# EAGLE design jan_ray (EAGLE 7.6.0)
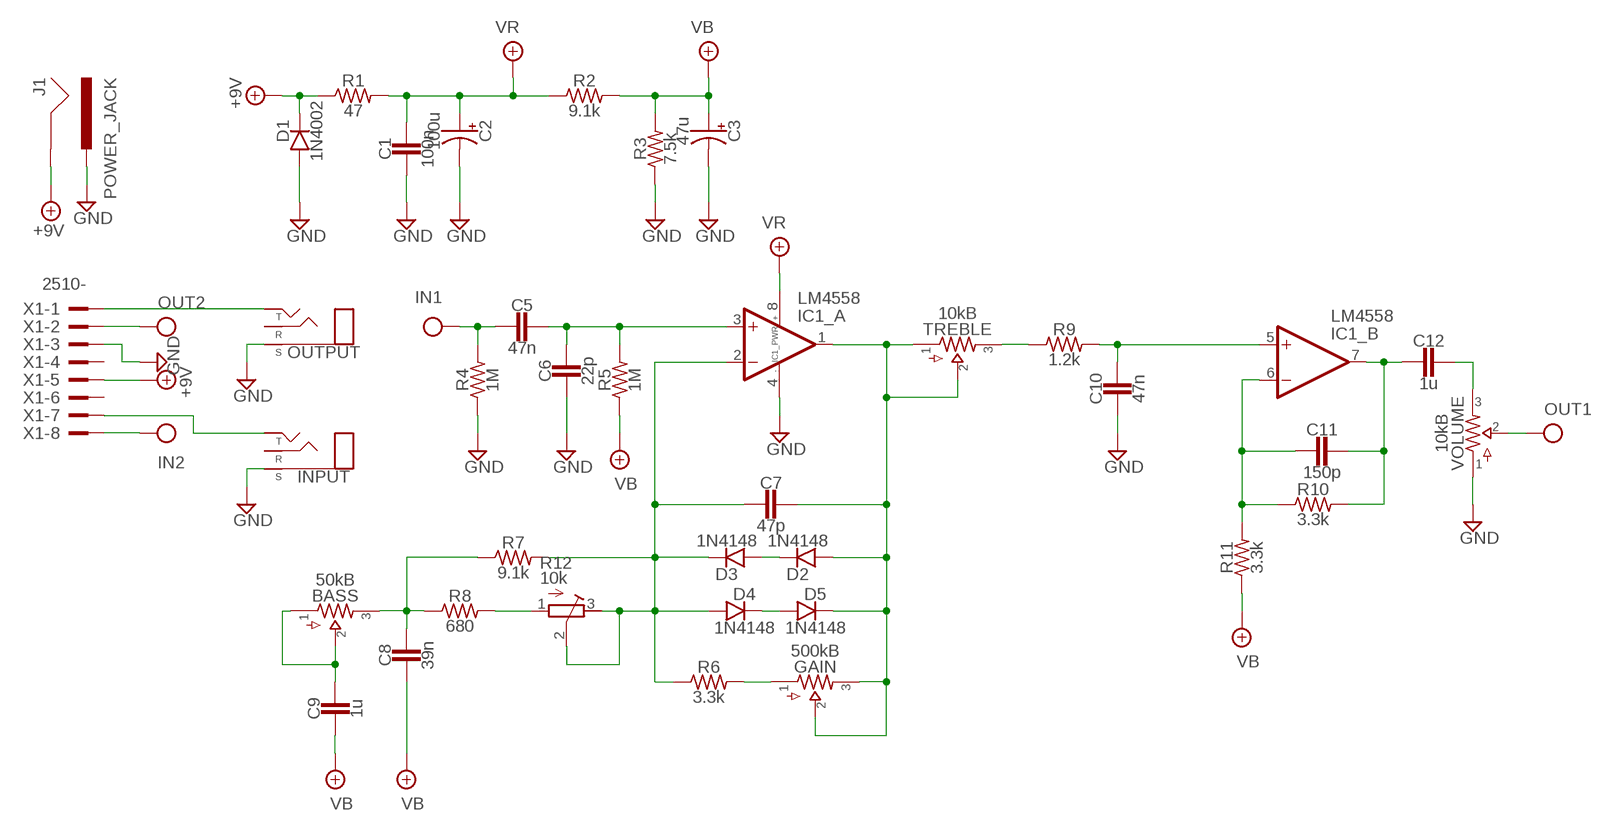
[diagram p0: schematic, sheet 1]

## Parts
BASS  50kB  POTS16MM  [16MM]
C1  100n  CER/FILM2  [050X030_025_2]
C2  100u  0500  [050_020]
C3  47u  0500  [050_020]
C5  47n  CER/FILMBOX.1  [BOX_SMALL]
C6  22p  CER/FILM2  [050X030_025_2]
C7  47p  CER/FILM2  [050X030_025_2]
C8  39n  CER/FILMBOX.1  [BOX_SMALL]
C9  1u  CER/FILMBOX.3  [BOX_BIG]
C10  47n  CER/FILMBOX.1  [BOX_SMALL]
C11  150p  CER/FILM2  [050X030_025_2]
C12  1u  CER/FILMBOX.3  [BOX_BIG]
D1  1N4002  DO41.2  [DO41-2]
D2  1N4148  DO35.2  [DO35-2]
D3  1N4148  DO35.2  [DO35-2]
D4  1N4148  DO35.2  [DO35-2]
D5  1N4148  DO35.2  [DO35-2]
GAIN  500kB  POTS16MM  [16MM]
IC1  LM4558  DUALTH  [DIL08]
INPUT  STEREONMJ  [NMJ6HCD2]
J1  POWER_JACK  [POWER_JACK_PTH]
OUTPUT  STEREONMJ  [NMJ6HCD2]
R1  47  R_.3B  [R0207/3]
R2  9.1k  R_.3B  [R0207/3]
R3  7.5k  R_.3B  [R0207/3]
R4  1M  R_.3B  [R0207/3]
R5  1M  R_.3B  [R0207/3]
R6  3.3k  R_.3B  [R0207/3]
R7  9.1k  R_.3B  [R0207/3]
R8  680  R_.3B  [R0207/3]
R9  1.2k  R_.3B  [R0207/3]
R10  3.3k  R_.3B  [R0207/3]
R11  3.3k  R_.3B  [R0207/3]
R12  10k  R-TRIMM3296W  [RTRIM3296W]
TREBLE  10kB  POTS16MM  [16MM]
VOLUME  10kB  POTS16MM  [16MM]
X1  2510-  [PAK100/2500-10]

## Nets
+9V: D1.C J1.GND R1.1 X1.5
GND: C1.2 C2.- C3.- C6.2 C10.2 D1.A IC1.4(_PWR:V-) INPUT.S J1.PWR OUTPUT.S R3.1 R4.1 VOLUME.1 X1.3
IN: C5.2 R4.2 X1.8
N$2: INPUT.T X1.7
N$3: C5.1 C6.1 IC1.3(_A:+IN) R5.2
N$4: OUTPUT.T X1.1
N$5: C7.2 D3.C D4.A IC1.2(_A:-IN) R6.1 R7.2 R12.2(S) R12.3(E)
N$6: C7.1 D2.A D5.C GAIN.2 GAIN.3 IC1.1(_A:OUT) TREBLE.1 TREBLE.2
N$7: GAIN.1 R6.2
N$8: D2.C D3.A
N$9: D4.C D5.A
N$10: R8.2 R12.1(A)
N$11: BASS.3 C8.1 R7.1 R8.1
N$12: R9.1 TREBLE.3
N$13: BASS.1 BASS.2 C9.1
N$14: C10.1 IC1.5(_B:+IN) R9.2
N$15: C11.2 IC1.6(_B:-IN) R10.1 R11.2
N$16: C11.1 C12.2 IC1.7(_B:OUT) R10.2
N$17: C12.1 VOLUME.3
OUT: VOLUME.2 X1.2
VB: C3.+ C8.2 C9.2 R2.2 R3.2 R5.1 R11.1
VR: C1.1 C2.+ IC1.8(_PWR:V+) R1.2 R2.1
Unconnected: INPUT.R OUTPUT.R X1.4 X1.6

## Library data of the parts
BASS GAIN TREBLE VOLUME = pedals-potentiometers:POTS
C1 C5-C12 = pedals-capacitors-film:CER/FILM: 47 - 120pF Xicon Ceramic Disc 2.5mm lead spacing
C2 C3 = pedals-capacitors-elec:050
D1 = pedals-diodes:DO41: DO-41 Package Diodes: 1N4001 - 1N40019 Zener Diodes: 1N4728 - 1N4764
D2-D5 = pedals-diodes:DO35: DO-35 Package Diodes: 1N914
IC1 = pedals-integrated circuits:DUAL: OP AMP
INPUT OUTPUT = pedals-jacks:STEREO
J1 = pedals-jacks:POWER_JACK: Power Jack Connector This is the standard 5.5mm barrel jack for power. The PTH is the most common, proven, reliable, footprint. The Slot footprint only works if the mill layer is transmitted to the PCB fab house so be warned. Here are the connectors we sell at SparkFun: DC Barrel Power Jack/Connector <https://www.sparkfun.com/products/119> (PRT-00119) DC Barrel Power Jack/Connector (SMD) <https://www.sparkfun.com/products/12748> (PRT-12748) DC Barrel Jack Adapter - Breadboard Compatible <https://www.sparkfun.com/products/10811> (PRT-10811) It is used on this SparkFun product (and many, many others): SparkFun RedBoard - Programmed with Arduino <https://www.sparkfun.com/products/12757> (DEV-12757) Also, if you need a mating power supply or connector, please check these out: Wall Adapter Power Supply - 9VDC 650mA <https://www.sparkfun.com/products/298> (TOL-00298) DC Barrel Jack Adapter - Male <https://www.sparkfun.com/products/10287> (PRT-10287); PROD_ID: CONN-08197
R1-R11 = pedals-resistors:R_
R12 = pedals-potentiometers:R-TRIMM: Trimm resistor
X1 = pedals-headers:2510-: 3M (TM) Pak 100 4-Wall Header Source: 3M; MF: 3M; MPN: 2510-6002UB; OC_FARNELL: 9838244; OC_NEWARK: 46F4725

## Board
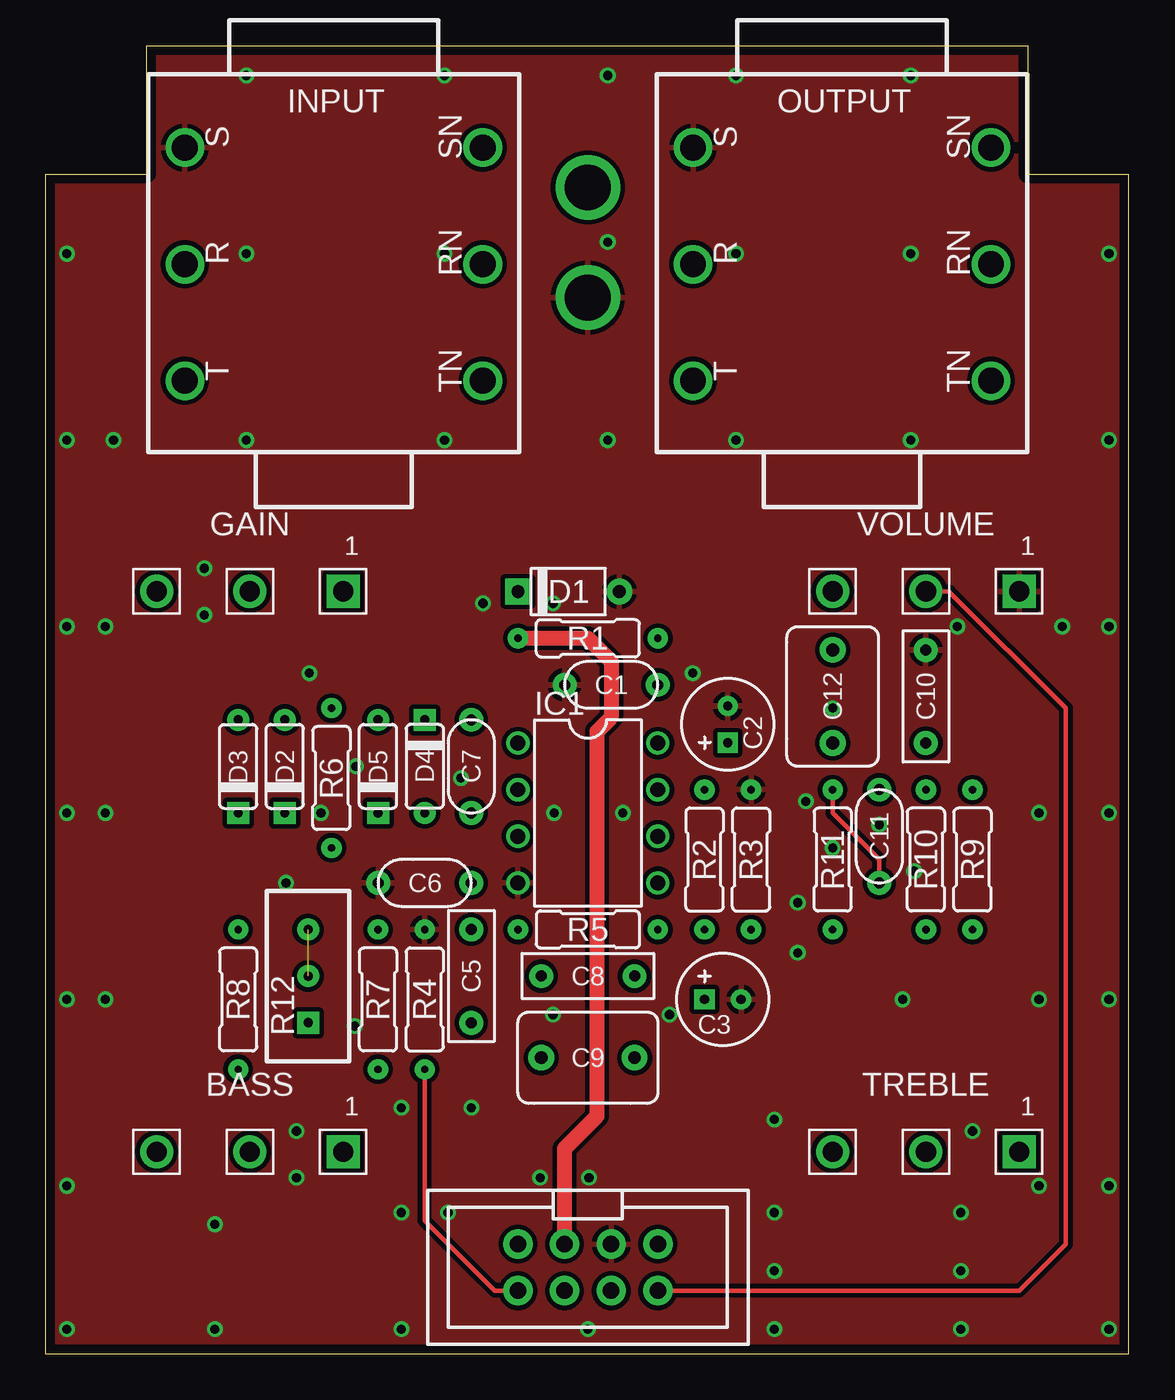
[diagram p1: board, top side]
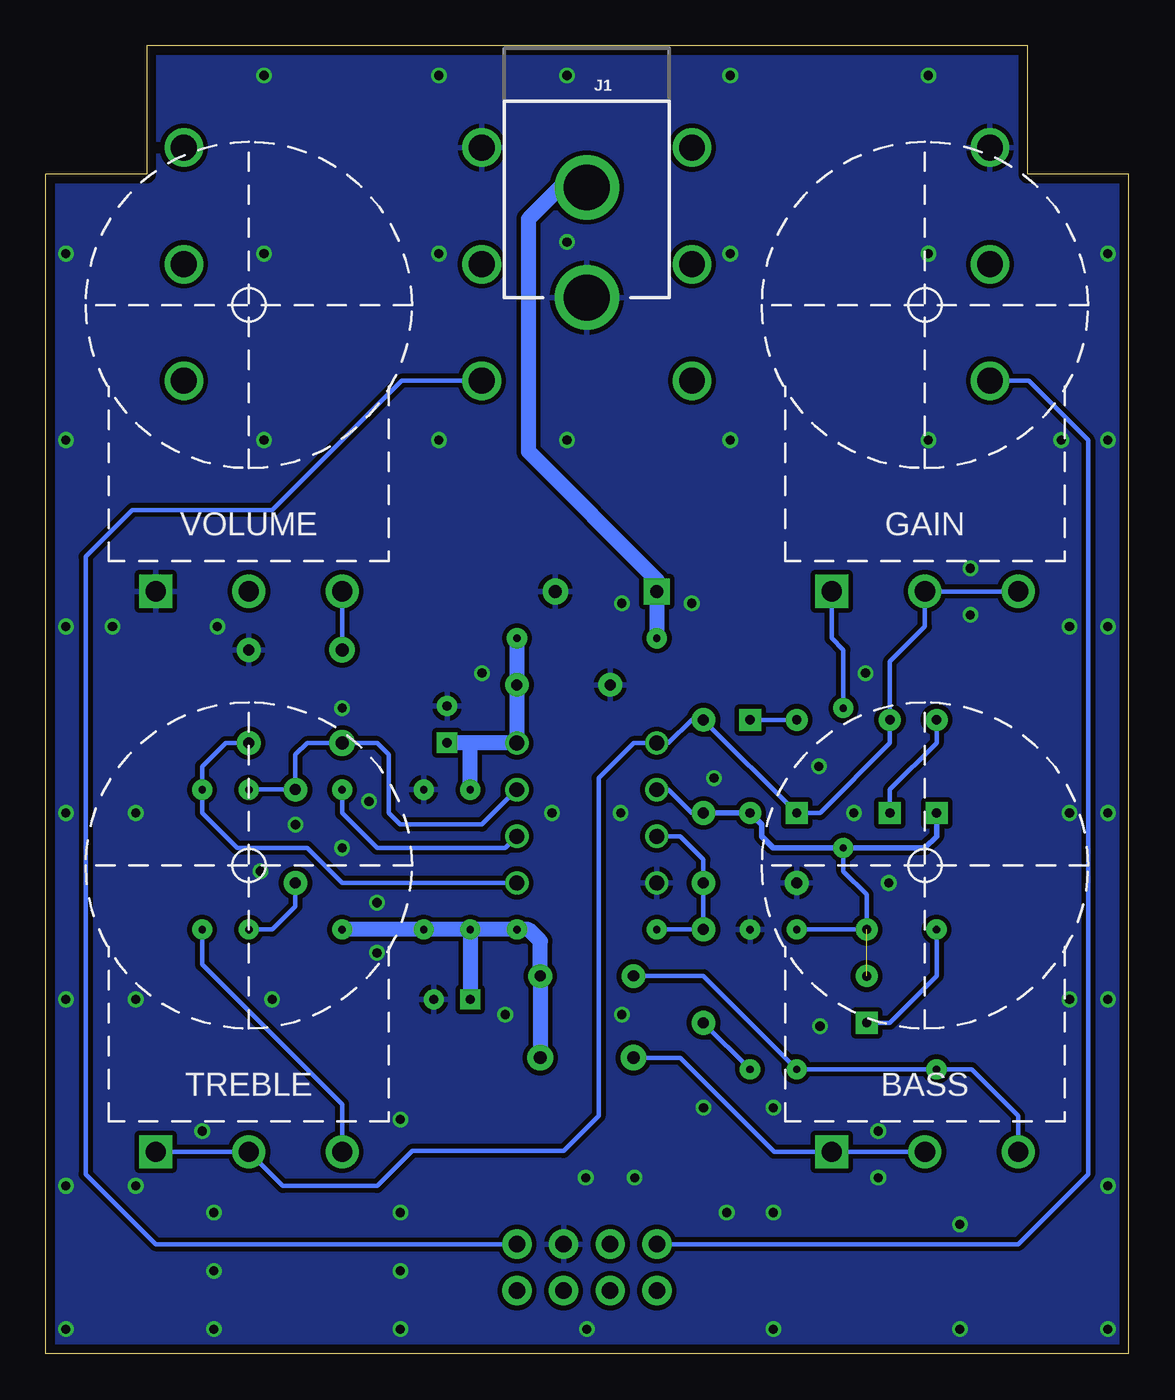
[diagram p2: board, bottom side, seen from below]

Size 59 x 71.27 mm. Coordinates in mm from the lower left corner, seen from the top.
Copper layers (1*16): Top 0.035mm / dielectric 1.6mm / Bottom 0.035mm
Design rules "Elecrow_2-layer_PCB_eagle_rule": minimum track width 6mil, minimum drill 12mil, track to track 6mil, track to pad 6mil, pad to pad 6mil, via to via 8mil, smd to smd 0mil, copper to edge 20mil, drill to drill 10mil, minimum pad ring 6mil, minimum via ring 6mil, stop-mask expansion 0mil, vias tented up to drill 100mil, thermal gap 10mil
tRestrict: 1 lines

### Footprints (pad centres in the part's own frame; a part is rotated, then mirrored left to right if it is on the bottom)
16MM = drill 1.1 pad 1.8 square: 1 5.08,-1 | drill 1.1 pad 1.8: 2 0,-1; 3 -5.08,-1
050X030_025_2 = drill 0.6 pad 1.3: 1 -2.54,0; 2 2.54,0
050_020 = drill 0.5 pad 1.1 square: + -0.998,0.001 | drill 0.5 pad 1.1: - 0.998,0.001
BOX_SMALL = drill 0.6 pad 1.3: 1 -2.54,0; 2 2.54,0
BOX_BIG = drill 0.7 pad 1.4: 1 -2.54,0; 2 2.54,0
DO41-2 = drill 0.7 pad 1.4: A 2.794,0 | drill 0.7 pad 1.4 square: C -2.731,0
DO35-2 = drill 0.5 pad 1.2: A 2.54,0 | drill 0.5 pad 1.2 square: C -2.54,0
DIL08 = drill 0.813 pad 1.27: 1 -3.81,-3.81; 2 -1.27,-3.81; 3 1.27,-3.81; 4 3.81,-3.81; 5 3.81,3.81; 6 1.27,3.81; 7 -1.27,3.81; 8 -3.81,3.81
NMJ6HCD2 = drill 1.4: R 0,8.115; RN 0,-8.115; S 6.35,8.115; SN 6.35,-8.115; T -6.35,8.115; TN -6.35,-8.115
POWER_JACK_PTH = drill 2.5: GND 0,7.7; PWR 0,13.7
R0207/3 = drill 0.4 pad 1.1: 1 -3.81,0; 2 3.81,0
RTRIM3296W = drill 0.5 pad 1.2 square: 1 0,-2.54 | drill 0.5 pad 1.2: 2 0,0; 3 0,2.54
PAK100/2500-10 = drill 0.9 pad 1.6: 1 -3.81,-1.27; 2 -3.81,1.27; 3 -1.27,-1.27; 4 -1.27,1.27; 5 1.27,-1.27; 6 1.27,1.27; 7 3.81,-1.27; 8 3.81,1.27

### Placement (x,y rotation side)
BASS  11.11,12 0 top
C1  30.8,36.45 180 top
C2  37.15,34.29 90 top
C3  36.88,19.3 0 top
C5  23.18,20.57 270 top
C6  20.64,25.65 180 top
C7  23.18,32 270 top
C8  29.53,20.57 0 top
C9  29.53,16.13 0 top
C10  47.94,35.81 90 top
C11  45.4,28.19 270 top
C12  42.86,35.81 270 top
D1  28.45,41.53 0 top
D2  13.02,32 90 top
D3  10.48,32 90 top
D4  20.64,32 270 top
D5  18.1,32 90 top
GAIN  11.11,42.55 0 top
IC1  29.53,29.46 270 top
INPUT  15.68,59.37 90 top
J1  29.53,71.25 180 bottom
OUTPUT  43.37,59.37 90 top
R1  29.53,38.99 0 top
R2  35.88,26.92 270 top
R3  38.42,26.92 270 top
R4  20.64,19.3 270 top
R5  29.53,23.11 180 top
R6  15.56,31.37 90 top
R7  18.1,19.3 90 top
R8  10.48,19.3 90 top
R9  50.48,26.92 90 top
R10  47.94,26.92 90 top
R11  42.86,26.92 90 top
R12  14.29,20.57 0 top
TREBLE  47.94,12 0 top
U$1  [125B_PCB]  0,1.27 0 top
VOLUME  47.94,42.55 0 top
X1  29.53,4.7 180 top

### Tracks (layer width: path | path; a pad name or v marks a point on that pad's centre or on a via)
+9V
  Top 0.813: X1.5 28.26,11.18 30.04,12.95 30.04,33.91 30.8,34.67 30.8,37.72 29.53,38.99 R1.1
  Bottom 0.813: J1.GND 31,63.55 32.7,61.85 32.7,49.15 25.72,42.16 D1.C R1.1
GND  (via drill 0.5 pad 0.85)
  other vias: 57.91,59.94 57.91,49.78 10.92,69.66 21.72,69.66 30.61,69.66 1.14,49.78 10.92,59.94 10.92,49.78 21.72,49.78 30.61,60.58 30.61,49.78 37.59,69.66 47.12,69.66 37.59,59.94 37.59,49.78 47.12,59.94 47.12,49.78 57.91,39.62 57.91,29.46 57.91,19.3 57.91,9.14 57.91,1.33 49.85,1.33 39.69,1.33 29.53,1.33 19.37,1.33 9.21,1.33 1.14,1.33 1.14,59.94 1.14,39.62 1.14,29.46 1.14,19.3 1.14,9.14 39.69,4.51 49.85,4.51 39.69,7.68 49.85,7.68 19.37,7.68 21.91,7.68 9.21,7.05 13.65,9.59 13.65,12.13 54.1,9.14 54.1,19.3 54.1,29.46 49.66,39.62 26.92,9.59 29.59,9.59 33.97,18.48 27.62,18.48 31.43,29.46 27.69,29.46 50.48,12.13 39.69,12.76 16.83,17.84 8.64,40.26 8.64,42.8 14.35,37.08 14.99,29.46 13.08,25.65 3.68,49.78 3.24,39.62 3.24,29.46 3.24,19.3 40.96,24.57 45.4,28.83 42.86,27.56 19.37,13.4 23.18,13.4 21.72,59.94 16.89,32 22.61,31.37 27.62,40.89 23.81,40.89 35.24,37.08 41.4,30.1 47.31,26.29 46.67,19.3 40.96,21.84 42.86,35.18 55.37,39.62
  pour Top (isolate 0.254): 0.32,70.74 58.74,70.74 58.74,-1.02 0.32,-1.02
  pour Bottom (isolate 0.254): 0.32,-0.38 59.37,-0.38 59.37,72.01 -0.32,72.01 -0.32,-0.38
IN
  Top 0.254: X1.8 24.45,3.43 20.64,7.24 R4.2
  Bottom 0.254: R4.2 C5.2
N$2
  Bottom 0.254: X1.7 6.03,5.97 2.22,9.78 2.22,49.78 5.46,53.02 INPUT.T
N$3
  Bottom 0.254: R5.2 C5.1 C6.1 23.18,26.92 24.45,28.19 IC1.3
N$4
  Bottom 0.254: X1.1 53.02,5.97 56.83,9.78 56.83,43.43 54.29,45.97 46.67,45.97 39.62,53.02 OUTPUT.T
N$5  (1 unrouted)
  Bottom 0.254: IC1.2 25.08,30.73 23.81,29.46 C7.2 | R7.2 R12.3 14.29,25.02 15.56,26.29 R6.1
  Bottom 0.305: C7.2 D4.A 20,28.83 20,28.19 19.37,27.56 R6.1 11.11,27.56 10.48,28.19 D3.C
N$6
  Bottom 0.254: TREBLE.1 TREBLE.2 46.08,9.14 40.96,9.14 39.05,11.05 30.8,11.05 28.89,12.95 28.89,31.37 26.99,33.27 IC1.1 25.08,33.27 23.81,34.54 C7.1 D5.C 16.83,29.46 13.02,33.27 D2.A 13.02,37.72 11.11,39.62 GAIN.2 GAIN.3
N$7
  Bottom 0.254: R6.2 15.56,38.35 16.19,38.99 GAIN.1
N$8
  Bottom 0.254: D3.A 10.48,33.27 13.02,30.73 D2.C
N$9
  Bottom 0.254: D5.A D4.C
N$10
  Bottom 0.254: R8.2 10.48,20.57 13.02,18.03 R12.1
N$11
  Bottom 0.254: BASS.3 6.03,12.95 8.57,15.49 R8.1 R7.1 23.18,20.57 C8.1
N$12
  Bottom 0.254: TREBLE.3 42.86,13.59 50.48,21.21 R9.1
N$13
  Bottom 0.254: BASS.2 BASS.1 19.32,11 24.45,16.13 C9.1
N$14
  Bottom 0.254: IC1.5 42.86,25.65 44.77,27.56 48.58,27.56 50.48,29.46 R9.2 50.48,32 49.21,33.27 C10.1
N$15
  Top 0.254: C11.2 45.4,26.92 42.86,29.46 R11.2
  Bottom 0.254: IC1.6 33.97,27.56 40.96,27.56 42.86,29.46 R11.2 | C11.2 45.4,24.38 46.67,23.11 R10.1
N$16
  Bottom 0.254: R10.2 C11.1 45.4,32.64 44.77,33.27 C12.2 40.96,33.27 40.32,32.64 40.32,29.46 39.69,28.83 35.24,28.83 IC1.7
N$17
  Bottom 0.254: VOLUME.3 C12.1
OUT
  Top 0.254: VOLUME.2 49.2,41.55 55.56,35.18 55.56,5.97 53.02,3.43 X1.2
VB
  Bottom 0.813: R2.2 R5.1 32.7,23.11 32.07,22.48 C8.2 C9.2 | R2.2 R3.2 R11.1 | R2.2 35.88,19.92 C3.+
VR
  Bottom 0.813: R1.2 C1.1 IC1.8 35.88,33.27 | 35.88,33.27 37.13,33.27 C2.+ | R2.1 35.88,33.27